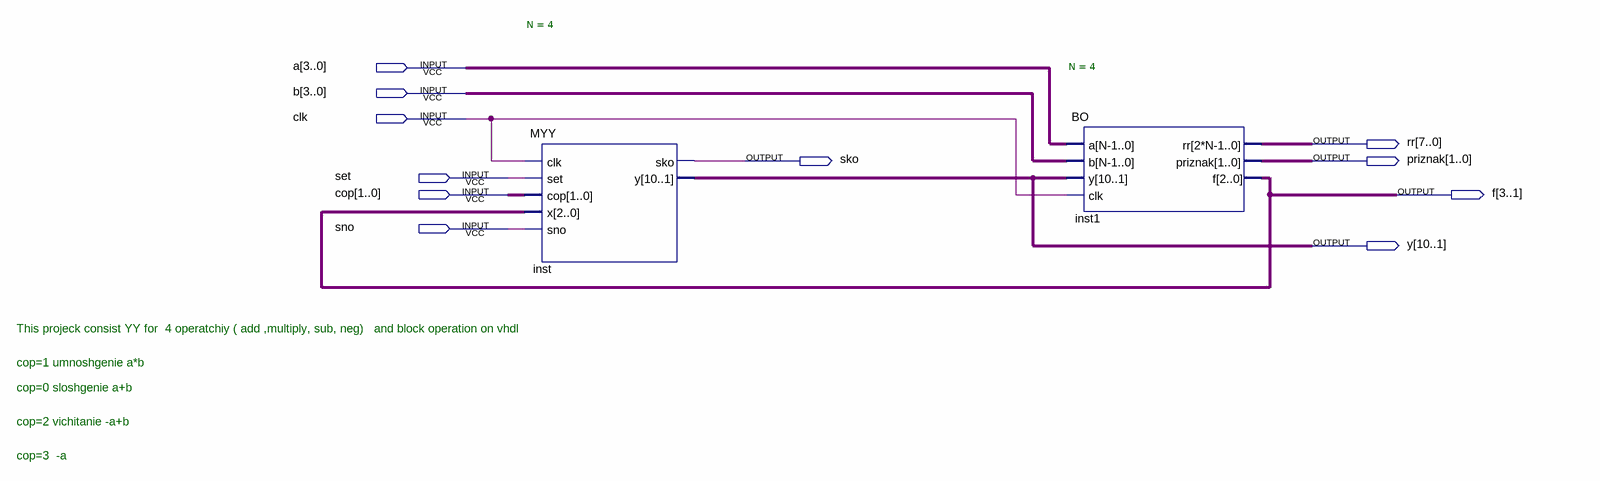
[diagram p0: schematic sheet]
// Quartus schematic control_unit_for_4op_BO.bdf as structural Verilog: 2 symbols, 11 pins
module control_unit_for_4op_BO (
  input  [3:0] a,
  input  [3:0] b,
  input  clk,
  input  set,
  input  [1:0] cop,
  input  sno,
  output [7:0] rr,
  output sko,
  output [1:0] priznak,
  output [3:1] f,
  output [10:1] y
);

  MYY #(.N(4)) inst (.clk(clk), .set(set), .cop(cop), .x(f), .sno(sno), .sko(sko), .y(y));
  BO #(.N(4)) inst1 (.a(a), .b(b), .y(y), .clk(clk), .rr(rr), .priznak(priznak), .f(f));

  // Notes on the sheet:
  //   This projeck consist YY for  4 operatchiy ( add ,multiply, sub, neg)   and block operation on vhdl
  //   cop=1 umnoshgenie a*b
  //   cop=0 sloshgenie a+b
  //   cop=2 vichitanie -a+b
  //   cop=3  -a
endmodule
